# Altium project 对射式红外传感器.PrjPCB
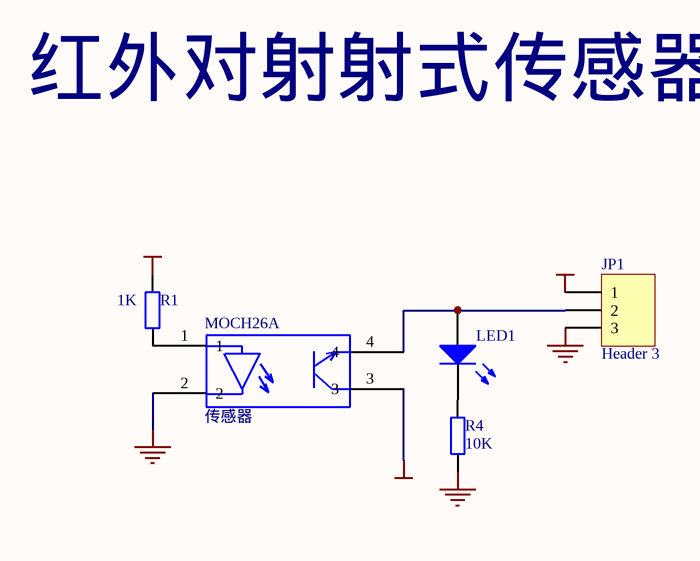
[diagram p0: 对射式红外传感器.SchDoc]
1 sheet, 5 parts. Net scope: global (net labels, ports and power ports of the same name join across sheets).
Board file: 对射式红外传感器.PcbDoc

## Sheet 对射式红外传感器.SchDoc
size A4

### Parts
JP1  Header 3  [HDR1X3]
LED1  (no value)  [HDR1X2]
MOCH26A  传感器  [MOCH26A]
R1  value 1K  [C1608-0603]
R4  value 10K  [C1608-0603]

### Nets
GND: JP1.3 MOCH26A.2 R4.2
VCC: JP1.1 MOCH26A.3 R1.2
NetJP1_2: JP1.2 LED1.1(A) MOCH26A.4
NetLED1_2: LED1.2(K) R4.1
NetMOCH26A_1: MOCH26A.1 R1.1

### Notes on the sheet
- 红外对射射式传感器

### Library data of the parts
JP1 = Header 3: Header, 3-Pin; LatestRevisionDate: 17-Jul-2002; LatestRevisionNote: Re-released for DXP Platform.; Publisher: Altium Limited
LED1 = LED3: Typical BLUE SiC LED; Published: 8-Jun-2000; LatestRevisionDate: 17-Dec-2003; LatestRevisionNote: PCB Footprint replaced.; Publisher: Altium Limited
R1 R4 = Res2: Resistor; Published: 8-Jun-2000; LatestRevisionDate: 17-Jul-2002; LatestRevisionNote: Re-released for DXP Platform.; Publisher: Altium Limited